# EAGLE design adapter (EAGLE 7.3.0)
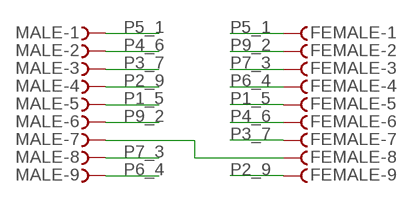
[diagram p0: schematic, sheet 1]

## Parts
FEMALE  F09HPS  [F09HP]
MALE  F09HPS  [F09HP]

## Nets
N$1: FEMALE.8 MALE.7
P1_5: FEMALE.5 MALE.5
P2_9: FEMALE.9 MALE.4
P3_7: FEMALE.7 MALE.3
P4_6: FEMALE.6 MALE.2
P5_1: FEMALE.1 MALE.1
P6_4: FEMALE.4 MALE.9
P7_3: FEMALE.3 MALE.8
P9_2: FEMALE.2 MALE.6

## Library data of the parts
FEMALE MALE = con-subd:F09?S: SUB-D; OC_FARNELL: unknown; OC_NEWARK: unknown

## Board
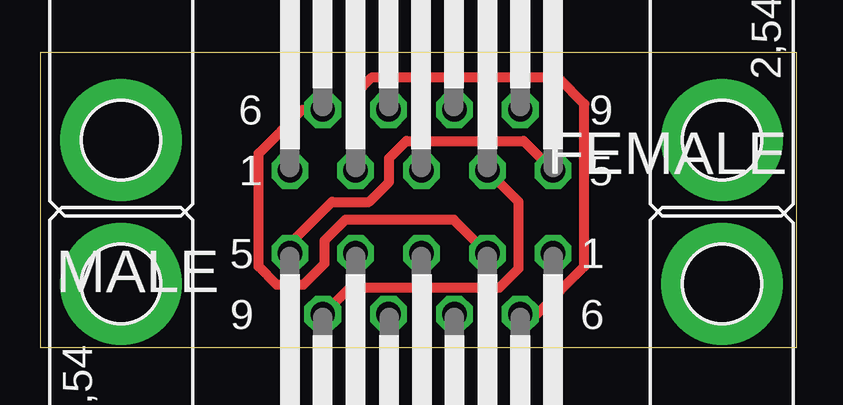
[diagram p1: board, top side]
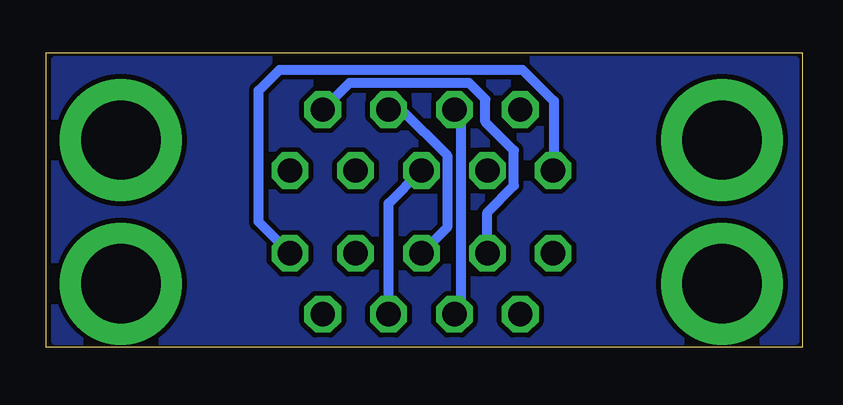
[diagram p2: board, bottom side, seen from below]

No outline drawn. Coordinates in mm, seen from the top.
Copper layers (1*16): Top 0.035mm / dielectric 1.5mm / Bottom 0.035mm
Design rules "default": minimum track width 10mil, minimum drill 24mil, track to track 8mil, track to pad 8mil, pad to pad 8mil, via to via 8mil, smd to smd 8mil, copper to edge 40mil, drill to drill 8mil, minimum pad ring 10mil, minimum via ring 8mil, stop-mask expansion 4mil, vias tented up to drill 0mil, thermal gap 10mil
Milling: 4 lines

### Footprints (pad centres in the part's own frame; a part is rotated, then mirrored left to right if it is on the bottom)
F09HP = drill 1.016 octagon: 1 -5.486,-1.27; 2 -2.743,-1.27; 3 0,-1.27; 4 2.743,-1.27; 5 5.486,-1.27; 6 -4.115,1.27; 7 -1.372,1.27; 8 1.372,1.27; 9 4.115,1.27 | drill 3.302 pad 5.08: G1 -12.522,0; G2 12.522,0

### Placement (x,y rotation side)
FEMALE  15.88,3.61 180 top
MALE  15.88,9.6 0 top

### Tracks (layer width: path | path; a pad name or v marks a point on that pad's centre or on a via)
GND
  pour Bottom: 0.32,12.9 31.11,12.9 31.11,1.27 0.32,1.27
N$1
  Bottom 0.406: MALE.7 14.49,10.87 14.25,10.64 14.25,2.6 FEMALE.8
P1_5
  Top 0.406: FEMALE.5 10.39,5.27 12.14,7.03 13.69,7.03 14.53,7.86 14.53,8.85 15.24,9.56 20.13,9.56 MALE.5
P2_9
  Top 0.406: FEMALE.9 11.79,2.34 12.9,3.45 19.13,3.45 19.92,4.25 19.92,7.03 MALE.4
P3_7
  Bottom 0.406: FEMALE.7 17.25,6.96 MALE.3
P4_6
  Top 0.406: MALE.2 13.14,11.55 13.81,12.22 21.55,12.22 22.66,11.11 22.66,4.33 20.68,2.34 FEMALE.6
P5_1
  Bottom 0.406: FEMALE.1 22.66,6.19 22.66,11.67 21.79,12.54 11.67,12.54 10.36,11.23 10.36,8.37 MALE.1
P6_4
  Bottom 0.406: FEMALE.4 13.13,6.59 12.03,7.7 12.03,9.17 13.22,10.36 13.22,11.31 13.89,11.99 18.88,11.99 MALE.9
P7_3
  Bottom 0.406: MALE.8 16.71,10.87 14.8,8.97 14.8,5.95 FEMALE.3
P9_2
  Top 0.406: FEMALE.2 17.22,6.27 12.7,6.27 11.83,5.4 11.83,4.45 10.95,3.57 9.84,3.57 9.09,4.33 9.09,9.05 10.91,10.87 MALE.6